# Altium project radxa_nx5_io_board_v1.4.PrjPcb (part 2 of 2)

## Sheet 12.SchDoc
size 420 x 297 mm
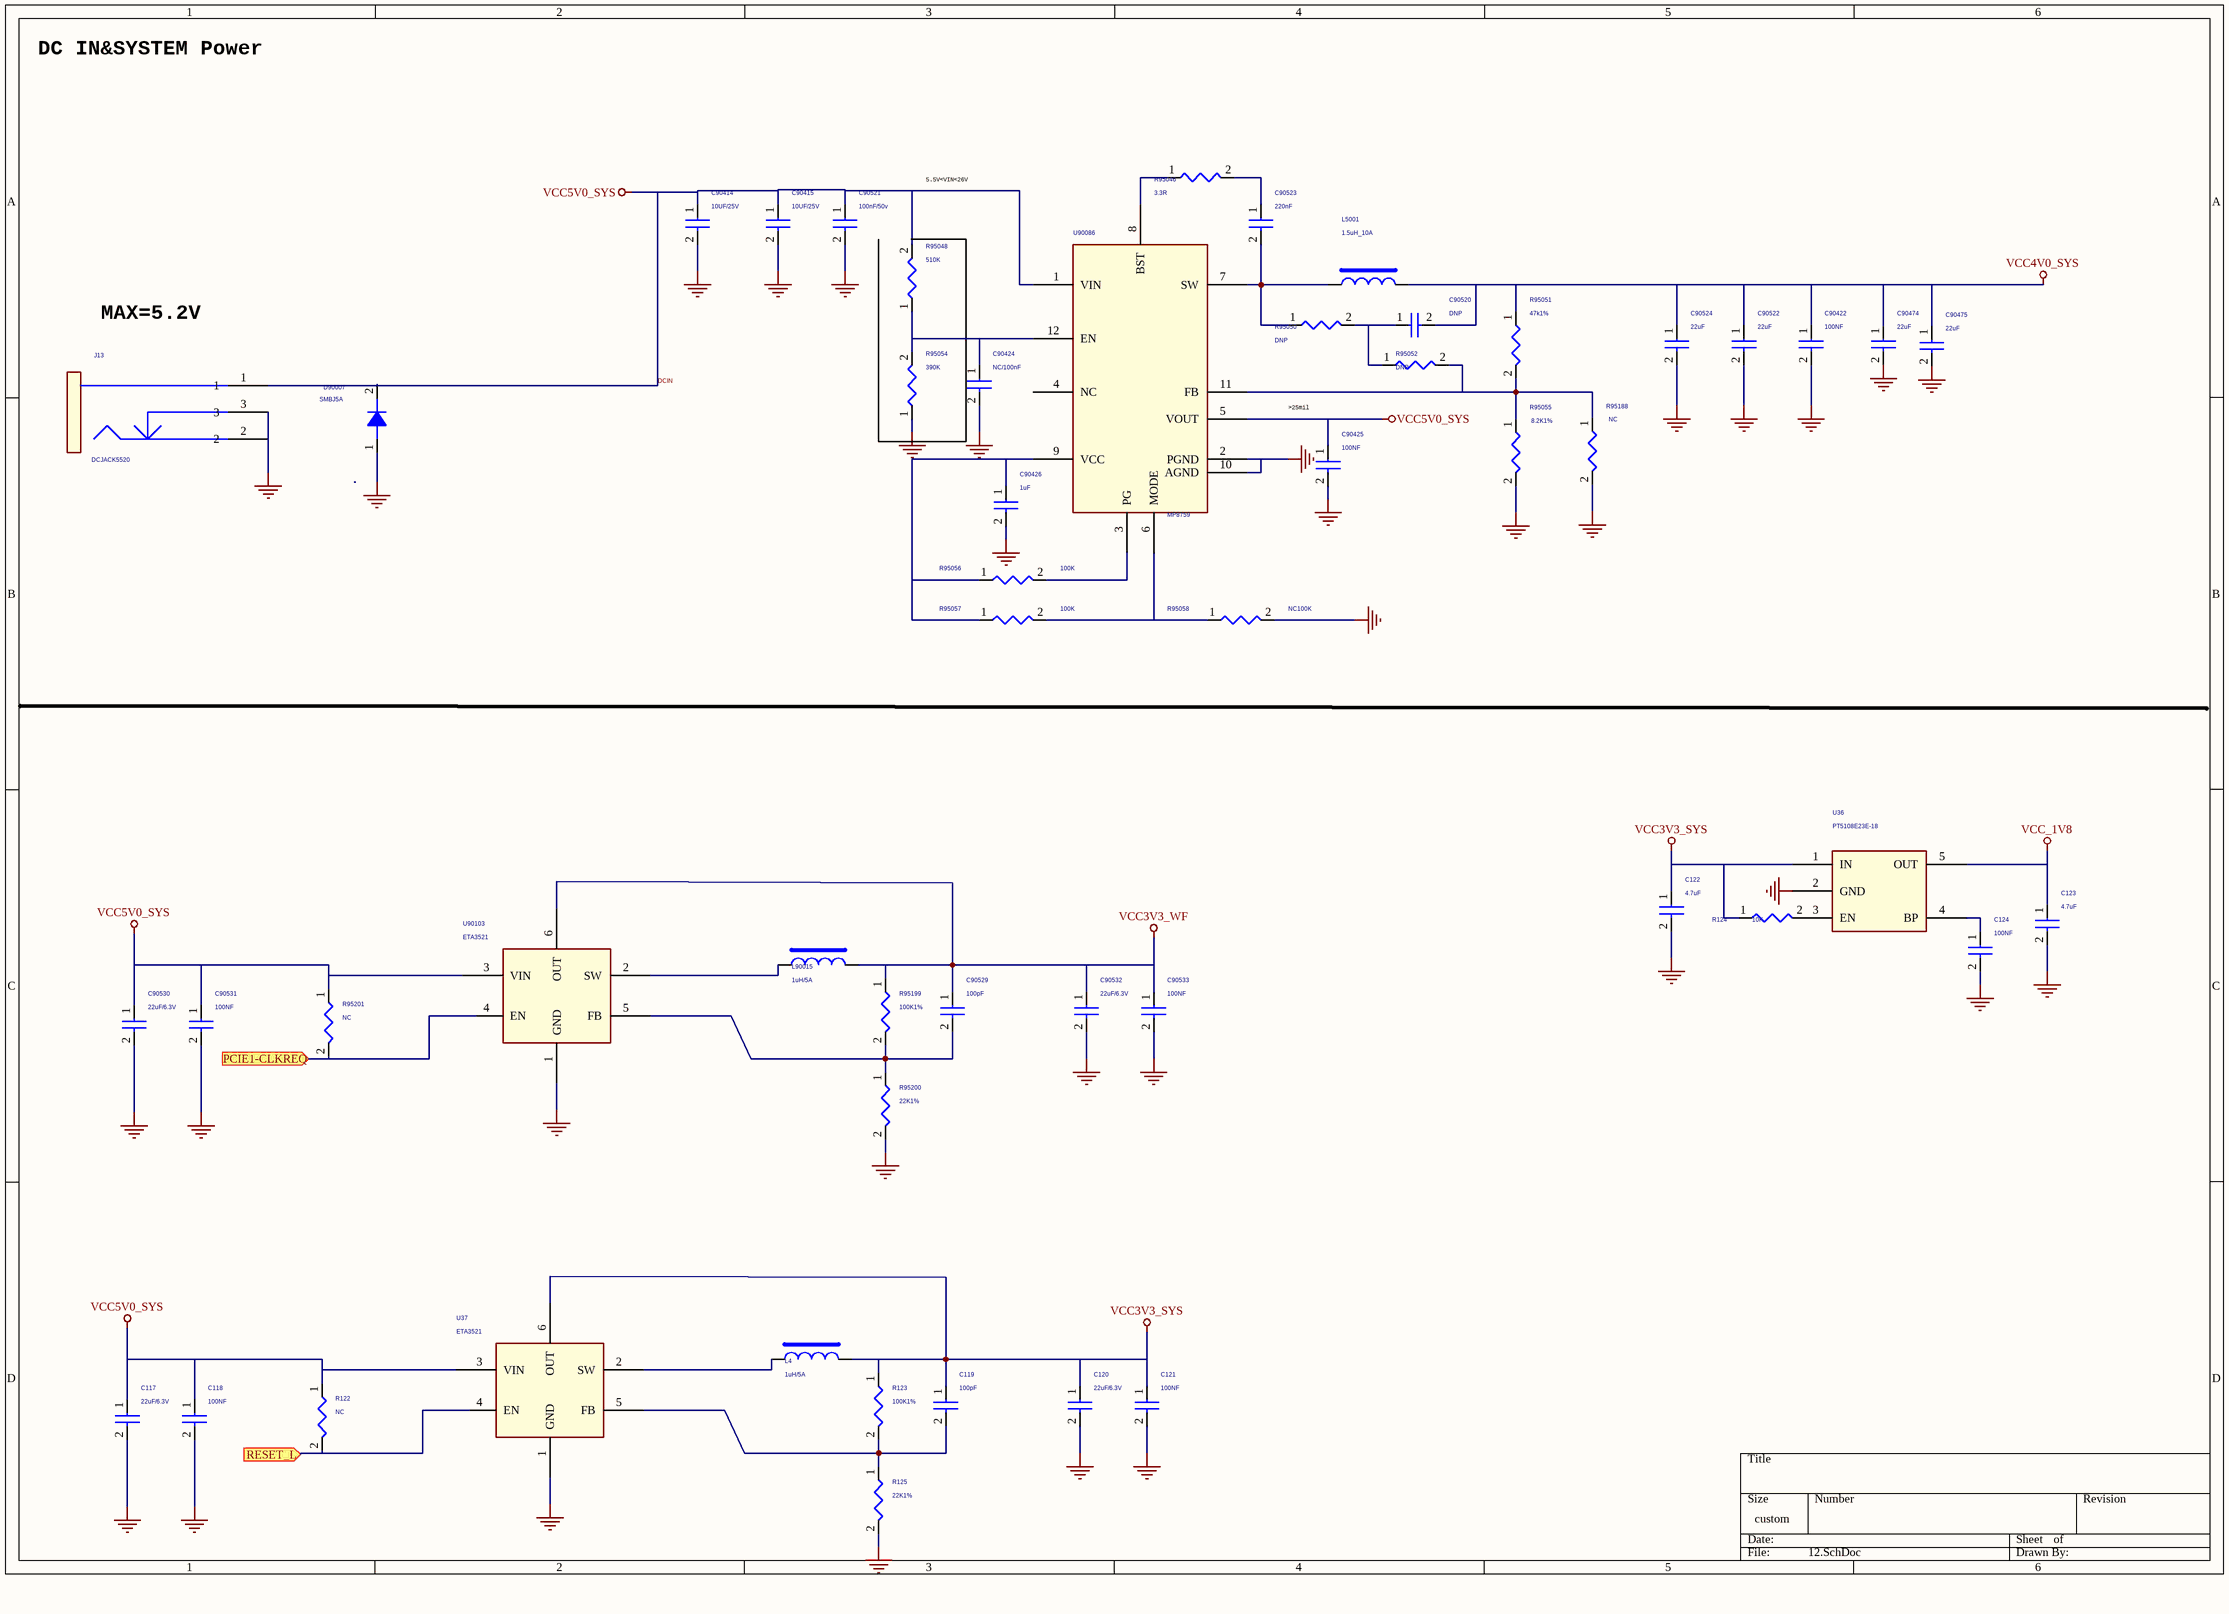
[diagram p12: 12.SchDoc]

### Parts
C117  22uF/6.3V  [C0805]
C118  100NF  [C0402]
C119  100pF  [C0402]
C120  22uF/6.3V  [C0805]
C121  100NF  [C0402]
C122  4.7uF  [c0402]
C123  4.7uF  [c0402]
C124  100NF  [C0402]
C90414  10UF/25V  [C1206]
C90415  10UF/25V  [C1206]
C90422  100NF  [C0402]
C90424  NC/100nF  [C0402]
C90425  100NF  [c0201]
C90426  1uF  [c0201]
C90474  22uF  [C0805]
C90475  22uF  [C0805]
C90520  DNP  [C0402]
C90521  100nF/50v  [C0603]
C90522  22uF  [C0805]
C90523  220nF  [C0402]
C90524  22uF  [C0805]
C90529  100pF  [C0402]
C90530  22uF/6.3V  [C0805]
C90531  100NF  [C0402]
C90532  22uF/6.3V  [C0805]
C90533  100NF  [C0402]
D90007  SMBJ5A  [DO214AA]
J13  DCJACK5520  [DCJACK5520]
L4  1uH/5A  [IND-303015]
L5001  1.5uH_10A  [IND_606045]
L90015  1uH/5A  [IND-303015]
R122  NC  [R0402]
R123  100K1%  [R0402]
R124  10K  [R0402]
R125  22K1%  [R0402]
R95046  3.3R  [R0402]
R95048  510K  [R0402]
R95050  DNP  [R0402]
R95051  47k1%  [R0402]
R95052  DNP  [R0402]
R95054  390K  [R0402]
R95055  8.2K1%  [R0402]
R95056  100K  [R0402]
R95057  100K  [R0402]
R95058  NC100K  [R0402]
R95188  NC  [R0402]
R95199  100K1%  [R0402]
R95200  22K1%  [R0402]
R95201  NC  [R0402]
U36  PT5108E23E-18  [SOT_23_5]
U37  ETA3521  [SOT563]
U90086  MP8759  [QFN12_2R00X3R00X1R00]
U90103  ETA3521  [SOT563]

### Ports
PCIE1-CLKREQ (in), RESET_L (in)

### Nets
DCIN: C117.1 C118.1 C90414.1 C90415.1 C90425.1 C90521.1 C90530.1 C90531.1 D90007.2(K) J13.1 R122.1 R95048.2 R95201.1 U37.3(VIN) U90086.1(VIN) U90086.5(VOUT) U90103.3(VIN)  [also labelled VCC5V0_SYS]
GND: C117.2 C118.2 C120.2 C121.2 C122.2 C123.2 C124.2 C90414.2 C90415.2 C90422.2 C90424.2 C90425.2 C90426.2 C90474.2 C90475.2 C90521.2 C90522.2 C90524.2 C90530.2 C90531.2 C90532.2 C90533.2 D90007.1(A) J13.2 J13.3 R125.2 R95054.1 R95055.2 R95058.2 R95188.2 R95200.2 U36.2(GND) U37.1(GND) U90086.2(PGND) U90086.10(AGND) U90103.1(GND)
VCC3V3_SYS: C119.1 C120.1 C121.1 C122.1 L4.2 R123.1 R124.1 U36.1(IN) U37.6(OUT)  [project net power-good]
VCC3V3_WF: C90529.1 C90532.1 C90533.1 L90015.2 R95199.1 U90103.6(OUT)
VCC4V0_SYS: C90422.1 C90474.1 C90475.1 C90520.2 C90522.1 C90524.1 L5001.2 R95051.1
VCC_1V8: C123.1 U36.5(OUT)
NetC119_2: C119.2 R123.2 R125.1 U37.5(FB)
NetC124_1: C124.1 U36.4(BP)
NetC90424_1: C90424.1 R95048.1 R95054.2 U90086.12(EN)
NetC90426_1: C90426.1 R95056.1 R95057.1 U90086.9(VCC)
NetC90520_1: C90520.1 R95050.2 R95052.1
NetC90523_1: C90523.1 R95046.2
NetC90523_2: C90523.2 L5001.1 R95050.1 U90086.7(SW)
NetC90529_2: C90529.2 R95199.2 R95200.1 U90103.5(FB)
NetL4_1: L4.1 U37.2(SW)
NetL90015_1: L90015.1 U90103.2(SW)
NetR122_2: R122.2 U37.4(EN) ; port RESET_L
NetR124_2: R124.2 U36.3(EN)
NetR95046_1: R95046.1 U90086.8(BST)
NetR95051_2: R95051.2 R95052.2 R95055.1 R95188.1 U90086.11(FB)
NetR95056_2: R95056.2 U90086.3(PG)
NetR95057_2: R95057.2 R95058.1 U90086.6(MODE)
NetR95201_2: R95201.2 U90103.4(EN) ; port PCIE1-CLKREQ

Not connected (* = marked no-connect by the designer): U90086 4(NC)

### Notes on the sheet
- DC IN&SYSTEM Power
- 5.5V<VIN<26V
- MAX=5.2V
- >25mil

### Library data of the parts
C117 C90530 = CAP NP: cap,10.00uF,+/-10%,25V,X5R,C0805; Manufacturer PN: C2012X5R1E106K085AC; Manufacturer: TDK; Tolerance: 10%; Priority: A; Voltage: 25V; Dielectric: X5R; Created by: JJJ; Part Type: C0805; RK PN: C2012X5R1E106K085AC
C118 = CAP NP: cap,100.00nF,+/-10%,25V,X5R,C0402; Manufacturer: TDK; RK PN: C1005X5R1E104K050BC; Priority: A; Tolerance: 10%; Voltage: 25V; Dielectric: X5R; Part Type: C0402; Manufacturer PN: C1005X5R1E104K050BC; Created by: JJJ
C119 C90529 = CAP NP: cap,100.00pF,+/-5%,50V,C0G,C0402; Manufacturer PN: C1005C0G1H101J050BA; Manufacturer: TDK; Tolerance: 5%; Priority: A; Voltage: 50V; Dielectric: C0G; Created by: JJJ; Part Type: C0402; RK PN: C1005C0G1H101J050BA
C120 C90532 = CAP NP: cap,10.00uF,+/-10%,10V,X5R,C0805; Manufacturer PN: C2012X5R1A106K125AB; Manufacturer: TDK; Tolerance: 10%; Priority: A; Voltage: 10V; Dielectric: X5R; Created by: JJJ; Part Type: C0805; RK PN: C2012X5R1A106K125AB
C121 C90533 = CAP NP: cap,100.00nF,+/-10%,10V,X5R,C0402; Manufacturer: TDK; RK PN: C1005X5R1A104K050BA; Priority: A; Tolerance: 10%; Voltage: 10V; Dielectric: X5R; Part Type: C0402; Manufacturer PN: C1005X5R1A104K050BA; Created by: JJJ
C122 = CAP NP: cap,4.70uF,+/-10%,10V,X5R,C0603; Manufacturer PN: C1608X5R1A475K080AC; Manufacturer: TDK; Tolerance: 10%; Priority: A; Voltage: 10V; Dielectric: X5R; Created by: JJJ; Part Type: C0603; RK PN: C1608X5R1A475K080AC
C123 = CAP NP: cap,4.70uF,+/-10%,10V,X5R,C0603; Manufacturer: TDK; RK PN: C1608X5R1A475K080AC; Priority: A; Tolerance: 10%; Voltage: 10V; Dielectric: X5R; Part Type: C0603; Manufacturer PN: C1608X5R1A475K080AC; Created by: JJJ
C124 = CAP NP: as C90195 on sheet 07; Voltage: 16V; Dielectric: X5R; Part Type: C0402; Manufacturer PN: C1005X5R1C104K050BA; Created by: JJJ
C90414 = CAP NP: cap,10.00uF,+/-10%,25V,X5R,C1206; Manufacturer PN: C3216X5R1E106K085AC; Manufacturer: TDK; Tolerance: 10%; C_Voltage: 6.3V; Priority: A; Voltage: 25V; Dielectric: X5R; Created by: JJJ; Part Type: C1206; RK PN: C3216X5R1E106K085AC
C90415 = CAP NP: cap,10.00uF,+/-10%,25V,X5R,C1206; Manufacturer: TDK; RK PN: C3216X5R1E106K085AC; Priority: A; C_Voltage: 6.3V; Tolerance: 10%; Voltage: 25V; Dielectric: X5R; Part Type: C1206; Manufacturer PN: C3216X5R1E106K085AC; Created by: JJJ
C90422 C90425 = CAP NP: cap,100.00nF,+/-10%,10V,X5R,C0402; Manufacturer: TDK; Number: 37; RK PN: C1005X5R1A104K050BA; Priority: A; Tolerance: 10%; C_Voltage: 6.3V; Voltage: 10V; Dielectric: X5R; Part Type: C0402; Manufacturer PN: C1005X5R1A104K050BA; Created by: JJJ
C90424 = CAP NP: cap,100.00nF,+/-10%,25V,X5R,C0402; Manufacturer PN: C1005X5R1E104K050BC; Manufacturer: TDK; C_Voltage: 6.3V; Tolerance: 10%; Priority: A; Number: 37; Option: DNP; Voltage: 25V; Dielectric: X5R; Created by: JJJ; Part Type: C0402; RK PN: C1005X5R1E104K050BC
C90426 = CAP NP: cap,1.00uF,+/-10%,10V,X5R,C0402; Manufacturer: TDK; Number: 37; RK PN: C1005X5R1A105K050BB; Priority: A; Tolerance: 10%; C_Voltage: 6.3V; Voltage: 10V; Dielectric: X5R; Part Type: C0402; Manufacturer PN: C1005X5R1A105K050BB; Created by: JJJ
C90474 C90475 C90524 = CAP NP: cap,22.00uF,+/-10%,10V,X5R,C0805; Manufacturer PN: C2012X5R1A226K125AB; Manufacturer: TDK; Tolerance: 10%; C_Voltage: 6.3V; Priority: A; Voltage: 10V; Dielectric: X5R; Created by: JJJ; Part Type: C0805; RK PN: C2012X5R1A226K125AB
C90520 = CAP NP: Did Not Place.; Manufacturer PN: DNPC0402; C_Voltage: 6.3V; Priority: A; Number: 37; Created by: JJJ; Part Type: DNP; RK PN: DNPC0402
C90521 = CAP NP: cap,100.00nF,+/-10%,50V,X5R,C0603; Manufacturer PN: C1608X5R1H104K080AA; Manufacturer: TDK; Tolerance: 10%; Priority: A; Voltage: 50V; Dielectric: X5R; Created by: JJJ; Part Type: C0603; RK PN: C1608X5R1H104K080AA
C90522 = CAP NP: cap,22.00uF,+/-10%,10V,X5R,C0805; Manufacturer: TDK; RK PN: C2012X5R1A226K125AB; Priority: A; C_Voltage: 6.3V; Tolerance: 10%; Voltage: 10V; Dielectric: X5R; Part Type: C0805; Manufacturer PN: C2012X5R1A226K125AB; Created by: JJJ
C90523 = CAP NP: cap,220.00nF,+/-10%,25V,X5R,C0402; Manufacturer PN: C1005X5R1E224K050BC; Manufacturer: TDK; C_Voltage: 6.3V; Tolerance: 10%; Priority: A; Number: 37; Voltage: 25V; Dielectric: X5R; Created by: JJJ; Part Type: C0402; RK PN: C1005X5R1E224K050BC
C90531 = CAP NP: cap,100.00nF,+/-10%,25V,X5R,C0402; Manufacturer PN: C1005X5R1E104K050BC; Manufacturer: TDK; Tolerance: 10%; Priority: A; Voltage: 25V; Dielectric: X5R; Created by: JJJ; Part Type: C0402; RK PN: C1005X5R1E104K050BC
D90007 = DIODE_Dup2: Schottky Barrier，SS32 DO214AC; Manufacturer PN: SS32; Manufacturer: 星海; Priority: A; Created by: JJJ; Part Type: Schottky rectifier; RK PN: SS32
L4 L90015 = INDUCTORS OF FERRITE: Power Inductor,3.3uH,0.2,IND_404030; Manufacturer: sunlord; Isat: 3.3A; DC Resistor: 0.04ohm; RK PN: SWPA4030S3R3MT; Priority: A; Tolerance: 20%; Irms: 2.4A; Resonace frequency: 38M; Part Type: POWER_IND; Manufacturer PN: SWPA4030S3R3MT; Created by: YTL
L5001 = INDUCTORS OF FERRITE: Power Inductor,1.5uH,MWSA0603S-1R5MT; Manufacturer: Vishay; Isat: 9.6A; Priority: A; Tolerance: 20%; Irms: 10.5A; Option: >8A; Part Type: IND; Created by: JJJ
R122 R95054 R95057 R95201 = RESISTOR: as R95119 on sheet 04; Created by: YTL; Part Type: 通用厚膜电阻; RK PN: RC0402JR-07100KL
R123 R95199 = RESISTOR: 通用厚膜电阻,75K,+/-1%,R0402,1/16W.; Manufacturer PN: RC0402FR-0775KL; Manufacturer: YAGEO; Tolerance: 1%; Wattage: 1/16W; Priority: A; Created by: YTL; Part Type: 通用厚膜电阻; RK PN: RC0402FR-0775KL
R124 = RESISTOR: as R95096 on sheet 04; Part Type: 通用厚膜电阻; Manufacturer PN: RC0402JR-0710KL; Created by: YTL
R125 R95200 = RESISTOR: 通用厚膜电阻,10K,+/-1%,R0402,1/16W.; Manufacturer: YAGEO; Tolerance: 1%; RK PN: RC0402FR-0710KL; Priority: A; Wattage: 1/16W; Part Type: 通用厚膜电阻; Manufacturer PN: RC0402FR-0710KL; Created by: YTL
R95046 = RESISTOR: 通用厚膜电阻,3R3,+/-5%,R0402,1/16W.; Manufacturer PN: RC0402JR-073R3L; Manufacturer: YAGEO; Tolerance: 5%; Wattage: 1/16W; Priority: A; Created by: YTL; Part Type: 通用厚膜电阻; RK PN: RC0402JR-073R3L
R95048 = RESISTOR: 通用厚膜电阻,510K,+/-5%,R0402,1/16W.; Manufacturer PN: RC0402JR-07510KL; Manufacturer: YAGEO; Tolerance: 5%; Wattage: 1/16W; Priority: A; Created by: YTL; Part Type: 通用厚膜电阻; RK PN: RC0402JR-07510KL
R95050 R95052 = RESISTOR: Did Not Place.; RK PN: DNPR0402; Priority: A; Part Type: DNP; Manufacturer PN: DNPR0402; Created by: JJJ
R95051 = RESISTOR: 通用厚膜电阻,43K,+/-1%,R0402,1/16W.; Manufacturer: YAGEO; Tolerance: 1%; RK PN: RC0402FR-0743KL; Priority: A; Wattage: 1/16W; Part Type: 通用厚膜电阻; Manufacturer PN: RC0402FR-0743KL; Created by: YTL
R95055 R95188 = RESISTOR: 通用厚膜电阻,7K5,+/-1%,R0402,1/16W.; Manufacturer PN: RC0402FR-077K5L; Manufacturer: YAGEO; Tolerance: 1%; Wattage: 1/16W; Priority: A; Created by: YTL; Part Type: 通用厚膜电阻; RK PN: RC0402FR-077K5L
R95056 = RESISTOR: 通用厚膜电阻,100K,+/-5%,R0402,1/16W.; Manufacturer: YAGEO; Tolerance: 5%; RK PN: RC0402JR-07100KL; Priority: A; Wattage: 1/16W; Part Type: 通用厚膜电阻; Manufacturer PN: RC0402JR-07100KL; Created by: YTL
R95058 = RESISTOR: 通用厚膜电阻,100K,+/-5%,R0402,1/16W.; Manufacturer PN: RC0402JR-07100KL; Manufacturer: YAGEO; Tolerance: 5%; Wattage: 1/16W; Priority: A; Option: DNP; Created by: YTL; Part Type: 通用厚膜电阻; RK PN: RC0402JR-07100KL
U36 = LDO_PT5108: 1.8V Output,300mA, Low Dropout, Low Noise Ultra-Fast Without Bypass Capacitor CMOS LDO Regulator; Manufacturer PN: RT9193-18GB; Manufacturer: Richtek（立錡）; Priority: A; Created by: JJJ; Part Type: LDO; RK PN: RT9193-18GB
U90086 = MP8759_6

## Sheet 13.SchDoc
size 513 x 386 mm
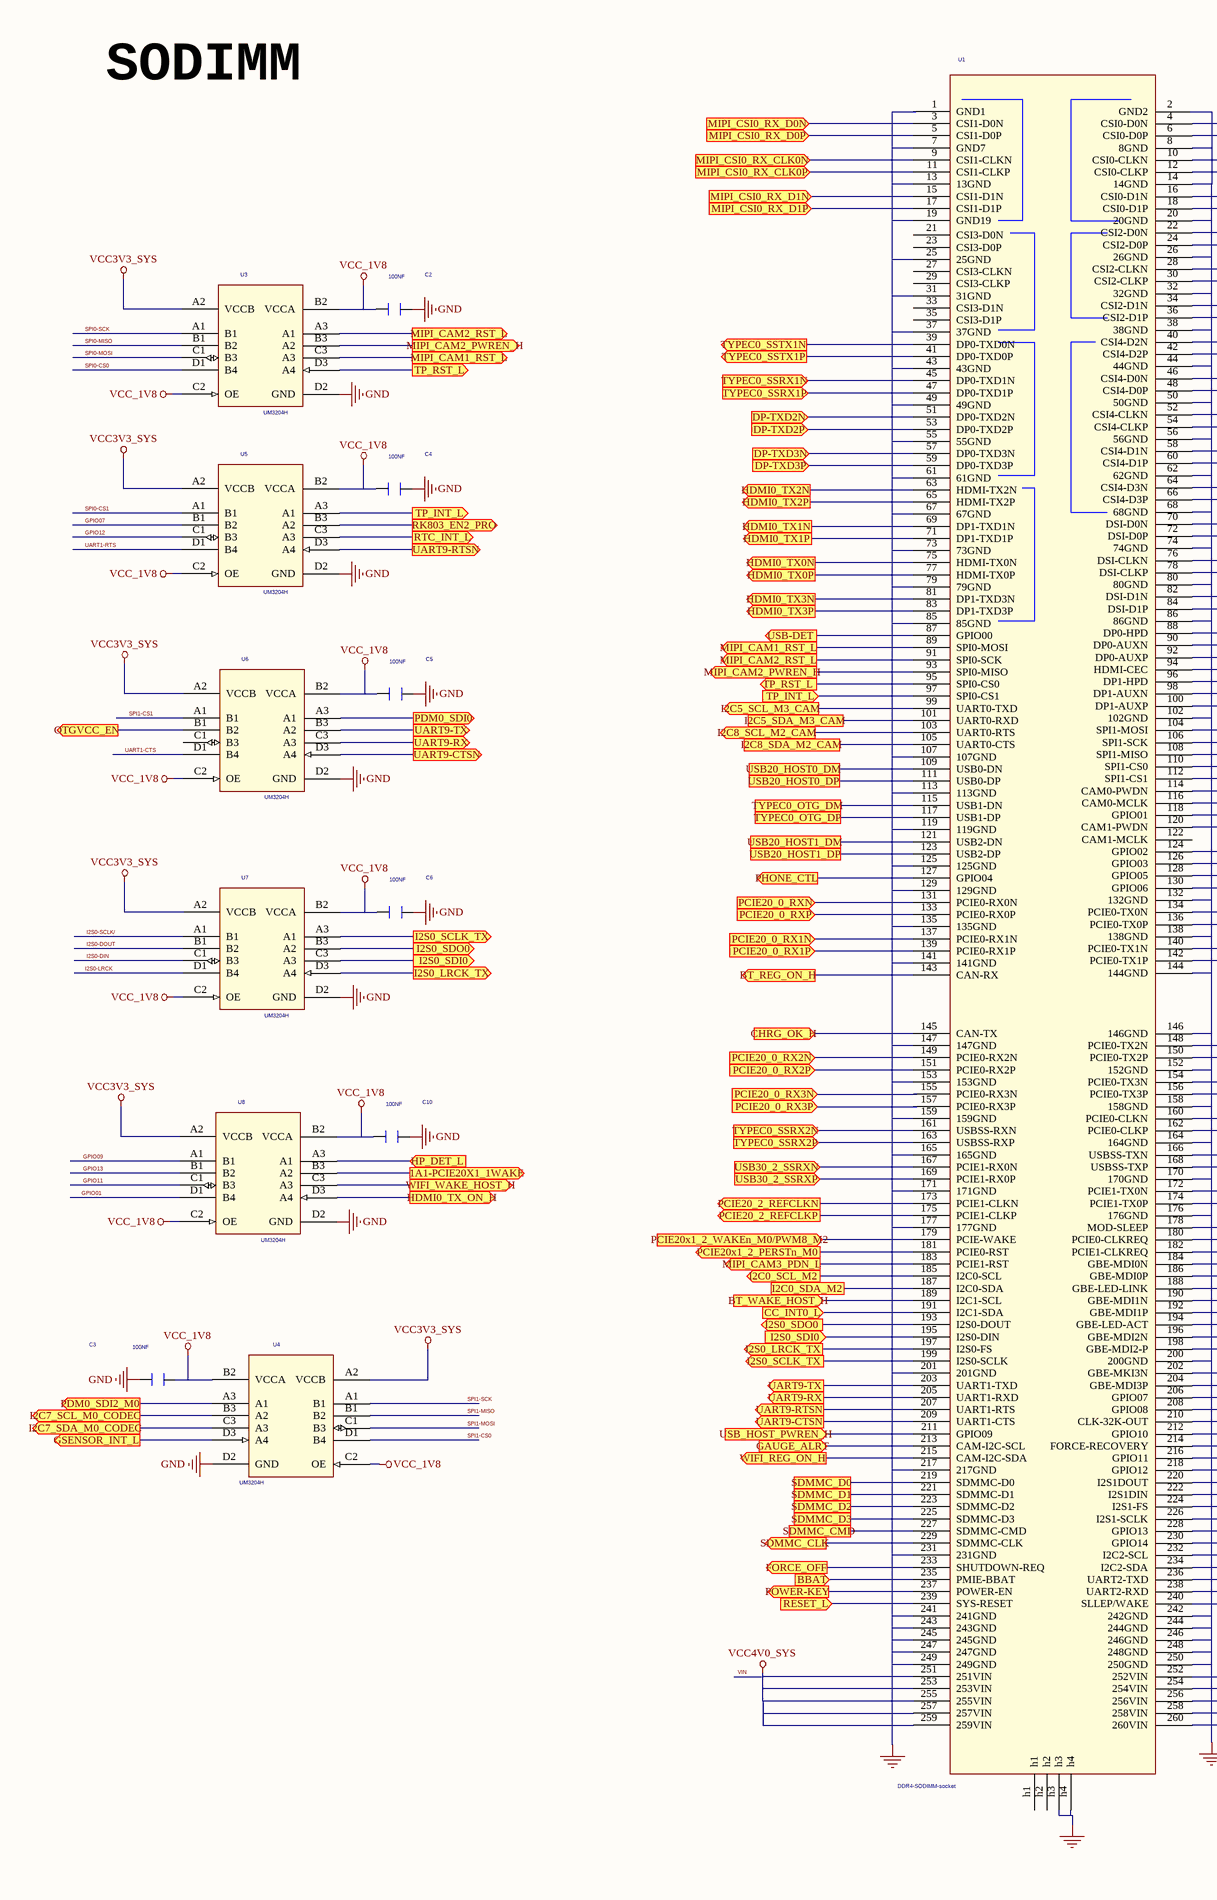
[diagram p13: 13.SchDoc, left]
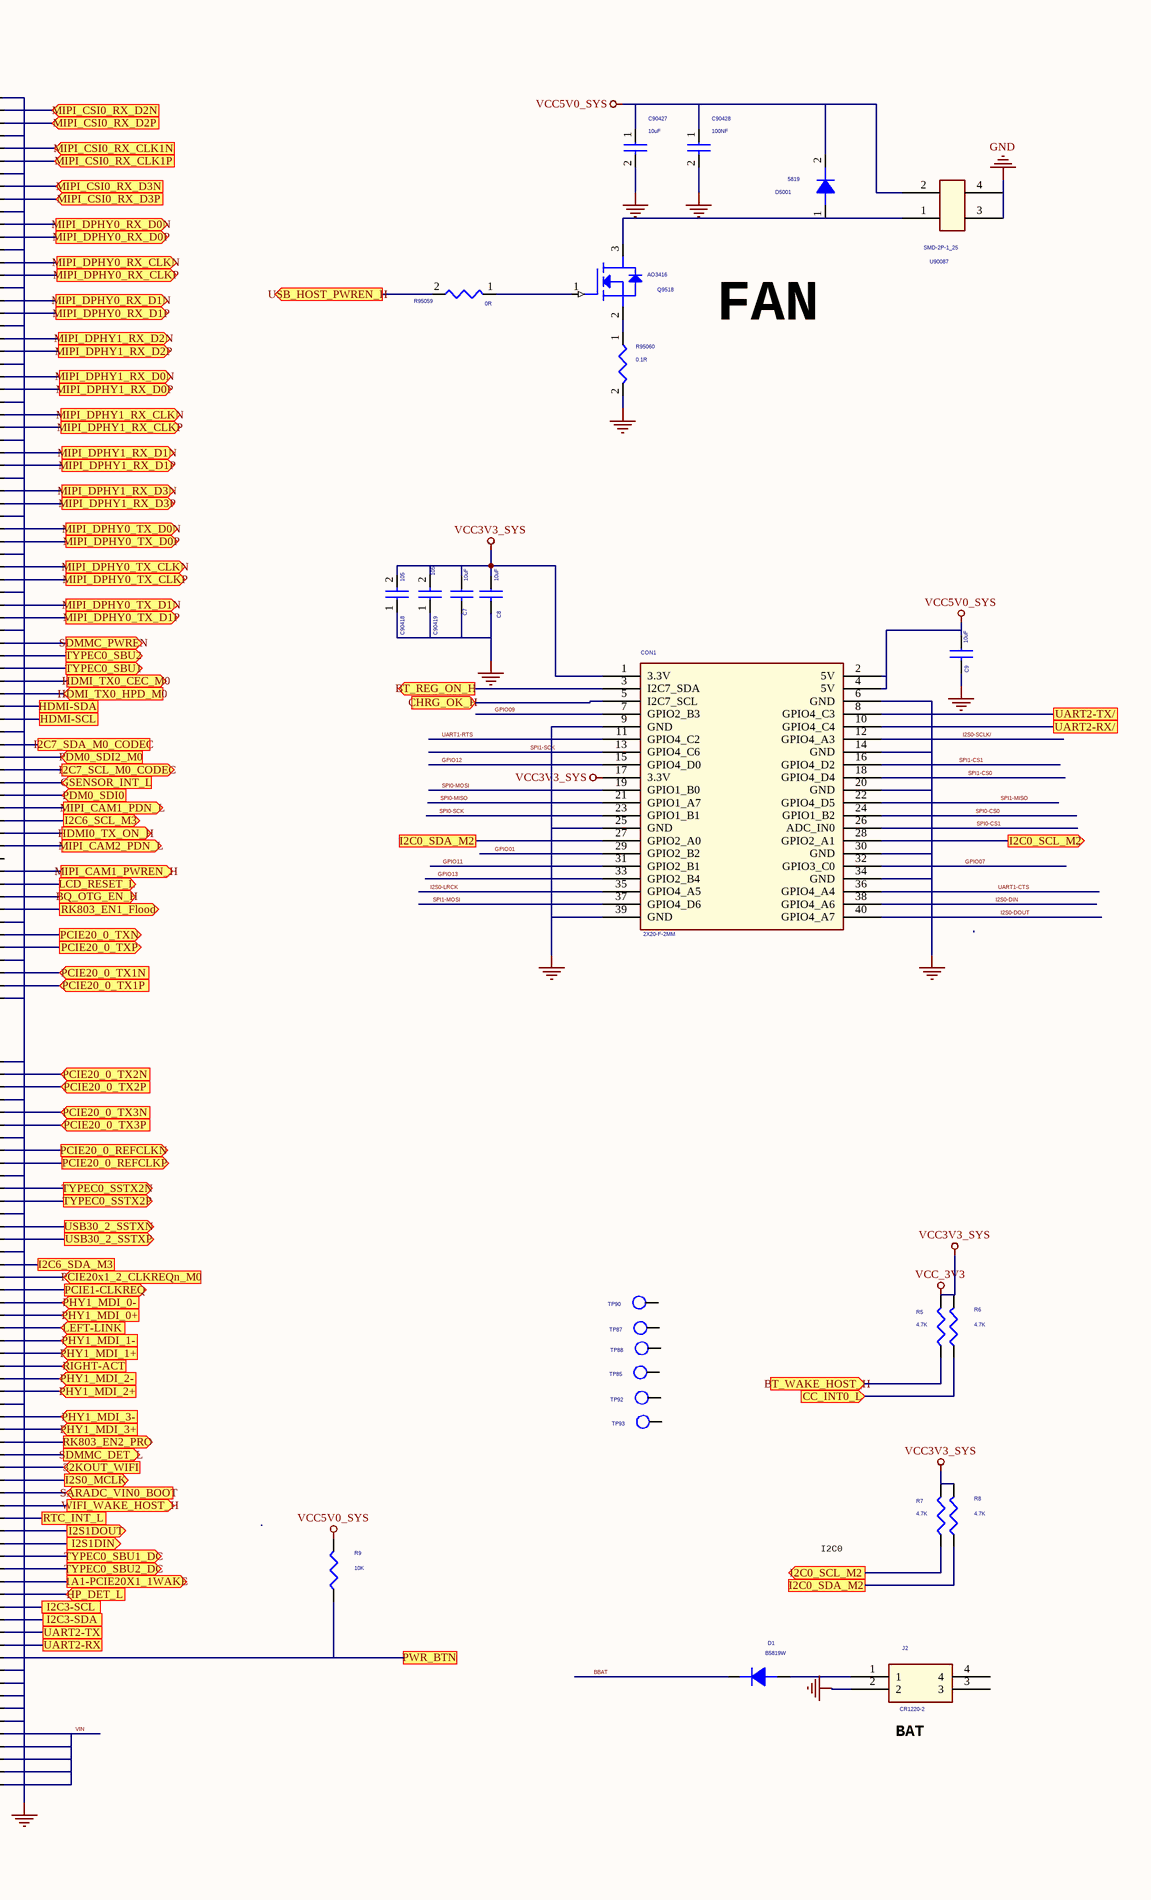
[diagram p14: 13.SchDoc, right]

### Parts
C2  100NF  [C0402]
C3  100NF  [C0402]
C4  100NF  [C0402]
C5  100NF  [C0402]
C6  100NF  [C0402]
C7  10uF  [C0603]
C8  10uF  [C0603]
C9  10uF  [C0603]
C10  100NF  [C0402]
C90418  105  [C0402]
C90419  105  [C0402]
C90427  10uF  [C1206]
C90428  100NF  [C0402]
CON1  2X20-F-2MM  [DIP40PIN-2.54MM_FX]
D1  B5819W  [SOD_123]
D5001  5819  [SOD_123]
J2  CR1220-2  [CR1220-2]
Q9518  AO3416  [SOT23]
R5  4.7K  [R0402]
R6  4.7K  [R0402]
R7  4.7K  [R0402]
R8  4.7K  [R0402]
R9  10K  [R0402]
R95059  0R  [R0402]
R95060  0.1R  [R0402]
TP85  TP  [tp1-8040]  (value not drawn)
TP87  TP  [tp1-8040]  (value not drawn)
TP88  TP  [tp1-8040]  (value not drawn)
TP90  TP  [tp1-8040]  (value not drawn)
TP92  TP  [tp1-8040]  (value not drawn)
TP93  TP  [tp1-8040]  (value not drawn)
U1  DDR4-SODIMM-socket  [DDR4-SODIMM-socket]
U3  UM3204H  [CSP-12]
U4  UM3204H  [CSP-12]
U5  UM3204H  [CSP-12]
U6  UM3204H  [CSP-12]
U7  UM3204H  [CSP-12]
U8  UM3204H  [CSP-12]
U90087  SMD-2P-1_25  [SMD-2P-1_25]

### Ports
1A1-PCIE20X1_1WAKE (out), 32KOUT_WIFI (in), BBAT (in), BQ_OTG_EN_H (out), BT_REG_ON_H (out), BT_WAKE_HOST_H (in), CC_INT0_L (in), CHRG_OK_H (in), DP-TXD2N (in), DP-TXD2P (in), DP-TXD3N (in), DP-TXD3P (in), FORCE_OFF (out), GAUGE_ALRT (in), GSENSOR_INT_L (in), GSENSOR_INT_L (out), HDMI0_TX0N (out), HDMI0_TX0P (out), HDMI0_TX1N (out), HDMI0_TX1P (out), HDMI0_TX2N (out), HDMI0_TX2P (out), HDMI0_TX3N (out), HDMI0_TX3P (out), HDMI0_TX_ON_H (out), HDMI-SCL, HDMI-SDA, HDMI_TX0_CEC_M0 (out), HDMI_TX0_HPD_M0 (in), HP_DET_L (in), I2C0_SCL_M2 (out), I2C0_SDA_M2, I2C3-SCL, I2C3-SDA, I2C5_SCL_M3_CAM (out), I2C5_SDA_M3_CAM, I2C6_SCL_M3 (out), I2C6_SDA_M3, I2C7_SCL_M0_CODEC (out), I2C7_SDA_M0_CODEC, I2C7_SDA_M0_CODEC (out), I2C8_SCL_M2_CAM (out), I2C8_SDA_M2_CAM, I2S0_LRCK_TX (out), I2S0_MCLK (out), I2S0_SCLK_TX (out), I2S0_SDI0 (in), I2S0_SDI0 (out), I2S0_SDO0 (out), I2S1DIN (out), I2S1DOUT (out), LCD_RESET_L (out), LEFT-LINK (in), MIPI_CAM1_PDN_L (out), MIPI_CAM1_PWREN_H (out), MIPI_CAM1_RST_L (out), MIPI_CAM2_PDN_L (out), MIPI_CAM2_PWREN_H (out), MIPI_CAM2_RST_L (out), MIPI_CAM3_PDN_L (out), MIPI_CSI0_RX_CLK0N (in), MIPI_CSI0_RX_CLK0P (in), MIPI_CSI0_RX_CLK1N (in), MIPI_CSI0_RX_CLK1P (in), MIPI_CSI0_RX_D0N (in), MIPI_CSI0_RX_D0P (in), MIPI_CSI0_RX_D1N (in), MIPI_CSI0_RX_D1P (in), MIPI_CSI0_RX_D2N (in), MIPI_CSI0_RX_D2P (in), MIPI_CSI0_RX_D3N (in), MIPI_CSI0_RX_D3P (in), MIPI_DPHY0_RX_CLKN (out), MIPI_DPHY0_RX_CLKP (out), MIPI_DPHY0_RX_D0N (out), MIPI_DPHY0_RX_D0P (out), MIPI_DPHY0_RX_D1N (out), MIPI_DPHY0_RX_D1P (out), MIPI_DPHY0_TX_CLKN (out), MIPI_DPHY0_TX_CLKP (out), MIPI_DPHY0_TX_D0N (out), MIPI_DPHY0_TX_D0P (out), MIPI_DPHY0_TX_D1N (out), MIPI_DPHY0_TX_D1P (out), MIPI_DPHY1_RX_CLKN (out), MIPI_DPHY1_RX_CLKP (out), MIPI_DPHY1_RX_D0N (out), MIPI_DPHY1_RX_D0P (out), MIPI_DPHY1_RX_D1N (out), MIPI_DPHY1_RX_D1P (out), MIPI_DPHY1_RX_D2N (out), MIPI_DPHY1_RX_D2P (out), MIPI_DPHY1_RX_D3N (out), MIPI_DPHY1_RX_D3P (out), OTGVCC_EN (out), PCIE1-CLKREQ (out), PCIE20_0_REFCLKN (out), PCIE20_0_REFCLKP (out), PCIE20_0_RX1N (in), PCIE20_0_RX1P (in), PCIE20_0_RX2N (in), PCIE20_0_RX2P (in), PCIE20_0_RX3N (in), PCIE20_0_RX3P (in), PCIE20_0_RXN (in), PCIE20_0_RXP (in), PCIE20_0_TX1N (in), PCIE20_0_TX1P (in), PCIE20_0_TX2N (in), PCIE20_0_TX2P (in), PCIE20_0_TX3N (in), PCIE20_0_TX3P (in), PCIE20_0_TXN (out), PCIE20_0_TXP (out), PCIE20_2_REFCLKN (out), PCIE20_2_REFCLKP (out), PCIE20x1_2_CLKREQn_M0 (in), PCIE20x1_2_PERSTn_M0 (out), PCIE20x1_2_WAKEn_M0/PWM8_M2 (in), PDM0_SDI0 (in), PDM0_SDI0 (out), PDM0_SDI2_M0 (in), PDM0_SDI2_M0 (out), PHONE_CTL (out), PHY1_MDI_0+ (in), PHY1_MDI_0- (in), PHY1_MDI_1+ (in), PHY1_MDI_1- (in), PHY1_MDI_2+ (in), PHY1_MDI_2- (in), PHY1_MDI_3+ (in), PHY1_MDI_3- (in), POWER-KEY (out), PWR_BTN, RESET_L (in), RIGHT-ACT (in), RK803_EN1_Flood (out), RK803_EN2_PRO (out), RTC_INT_L, RTC_INT_L (out), SARADC_VIN0_BOOT (in), SDMMC_CLK (out), SDMMC_CMD, SDMMC_D0, SDMMC_D1, SDMMC_D2, SDMMC_D3, SDMMC_DET_L (out), SDMMC_PWREN (out), TP_INT_L (in), TP_INT_L (out), TP_RST_L (out), TYPEC0_OTG_DM, TYPEC0_OTG_DP, TYPEC0_SBU1 (out), TYPEC0_SBU1_DC (out), TYPEC0_SBU2 (out), TYPEC0_SBU2_DC (out), TYPEC0_SSRX1N (in), TYPEC0_SSRX1P (in), TYPEC0_SSRX2N (in), TYPEC0_SSRX2P (in), TYPEC0_SSTX1N (out), TYPEC0_SSTX1P (out), TYPEC0_SSTX2N (out), TYPEC0_SSTX2P (out), UART2-RX, UART2-RX/, UART2-TX, UART2-TX/, UART9-CTSN (out), UART9-RTSN (out), UART9-RX (out), UART9-TX (out), USB20_HOST0_DM, USB20_HOST0_DP, USB20_HOST1_DM, USB20_HOST1_DP, USB30_2_SSRXN (in), USB30_2_SSRXP (in), USB30_2_SSTXN (out), USB30_2_SSTXP (out), USB-DET (out), USB_HOST_PWREN_H (in), USB_HOST_PWREN_H (out), WIFI_REG_ON_H (out), WIFI_WAKE_HOST_H (out)

### Nets
GND: C2.1 C3.1 C4.1 C5.1 C6.1 C7.2 C8.2 C9.2 C10.1 C90418.1 C90419.1 C90427.2 C90428.2 CON1.6(GND) CON1.9(GND) CON1.14(GND) CON1.20(GND) CON1.25(GND) CON1.30(GND) CON1.34(GND) CON1.39(GND) J2.2 R95060.2 U1.1(GND1) U1.2(GND2) U1.7(GND7) U1.8(8GND) U1.13(13GND) U1.14(14GND) U1.19(GND19) U1.20(20GND) U1.25(25GND) U1.26(26GND) U1.31(31GND) U1.32(32GND) U1.37(37GND) U1.38(38GND) U1.43(43GND) U1.44(44GND) U1.49(49GND) U1.50(50GND) U1.55(55GND) U1.56(56GND) U1.61(61GND) U1.62(62GND) U1.67(67GND) U1.68(68GND) U1.73(73GND) U1.74(74GND) U1.79(79GND) U1.80(80GND) U1.85(85GND) U1.86(86GND) U1.102(102GND) U1.107(107GND) U1.113(113GND) U1.119(119GND) U1.125(125GND) U1.129(129GND) U1.132(132GND) U1.135(135GND) U1.138(138GND) U1.141(141GND) U1.144(144GND) U1.146(146GND) U1.147(147GND) U1.152(152GND) U1.153(153GND) U1.158(158GND) U1.159(159GND) U1.164(164GND) U1.165(165GND) U1.170(170GND) U1.171(171GND) U1.176(176GND) U1.177(177GND) U1.200(200GND) U1.201(201GND) U1.217(217GND) U1.231(231GND) U1.241(241GND) U1.242(242GND) U1.243(243GND) U1.244(244GND) U1.245(245GND) U1.246(246GND) U1.247(247GND) U1.248(248GND) U1.249(249GND) U1.250(250GND) U1.h3 U1.h4 U3.D2(GND) U4.D2(GND) U5.D2(GND) U6.D2(GND) U7.D2(GND) U8.D2(GND) U90087.3 U90087.4
VCC3V3_SYS: C7.1 C8.1 C90418.2 C90419.2 CON1.1(3.3V) CON1.17(3.3V) R5.2 R6.2 R7.2 R8.2 U3.A2(VCCB) U4.A2(VCCB) U5.A2(VCCB) U6.A2(VCCB) U7.A2(VCCB) U8.A2(VCCB)  [also labelled VCC_3V3]  [project net power-good]
VCC4V0_SYS: U1.251(251VIN) U1.253(253VIN) U1.255(255VIN) U1.257(257VIN) U1.259(259VIN)
VCC5V0_SYS: C9.1 C90427.1 C90428.1 CON1.2(5V) CON1.4(5V) D5001.2(K) R9.2 U90087.2  [project net DCIN]
VCC_1V8: C2.2 C3.2 C4.2 C5.2 C6.2 C10.2 U3.B2(VCCA) U3.C2(OE) U4.B2(VCCA) U4.C2(OE) U5.B2(VCCA) U5.C2(OE) U6.B2(VCCA) U6.C2(OE) U7.B2(VCCA) U7.C2(OE) U8.B2(VCCA) U8.C2(OE)
BBAT: D1.2(K)
GPIO01: CON1.29(GPIO2_B2) U8.D1(B4)
GPIO07: CON1.32(GPIO3_C0) U5.B1(B2)
GPIO09: CON1.7(GPIO2_B3) U8.A1(B1)
GPIO11: CON1.31(GPIO2_B1) U8.C1(B3)
GPIO12: CON1.15(GPIO4_D0) U5.C1(B3)
GPIO13: CON1.33(GPIO2_B4) U8.B1(B2)
HDMI1_TX0N_PORT/eDP1_TX_D0N: U1.75(HDMI-TX0N) ; port HDMI0_TX0N
HDMI1_TX0P_PORT/eDP1_TX_D0P: U1.77(HDMI-TX0P) ; port HDMI0_TX0P
HDMI1_TX1N_PORT/eDP1_TX_D1N: U1.69(DP1-TXD1N) ; port HDMI0_TX1N
HDMI1_TX1P_PORT/eDP1_TX_D1P: U1.71(DP1-TXD1P) ; port HDMI0_TX1P
HDMI1_TX2N_PORT/eDP1_TX_D2N: U1.63(HDMI-TX2N) ; port HDMI0_TX2N
HDMI1_TX2P_PORT/eDP1_TX_D2P: U1.65(HDMI-TX2P) ; port HDMI0_TX2P
HDMI1_TX3N_PORT/eDP1_TX_D3N: U1.81(DP1-TXD3N) ; port HDMI0_TX3N
HDMI1_TX3P_PORT/eDP1_TX_D3P: U1.83(DP1-TXD3P) ; port HDMI0_TX3P
I2S0-DIN: CON1.38(GPIO4_A6) U7.C1(B3)
I2S0-DOUT: CON1.40(GPIO4_A7) U7.B1(B2)
I2S0-LRCK: CON1.35(GPIO4_A5) U7.D1(B4)
I2S0-SCLK/: CON1.12(GPIO4_A3) U7.A1(B1)
MDI0+: U1.186(GBE-MDI0P) ; port PHY1_MDI_0+
MDI0-: U1.184(GBE-MDI0N) ; port PHY1_MDI_0-
MDI1+: U1.192(GBE-MDI1P) ; port PHY1_MDI_1+
MDI1-: U1.190(GBE-MDI1N) ; port PHY1_MDI_1-
MDI2+: U1.198(GBE-MDI2-P) ; port PHY1_MDI_2+
MDI2-: U1.196(GBE-MDI2N) ; port PHY1_MDI_2-
MDI3+: U1.204(GBE-MDI3P) ; port PHY1_MDI_3+
MDI3-: U1.202(GBE-MKI3N) ; port PHY1_MDI_3-
SPI0-CS0: CON1.24(GPIO1_B2) U3.D1(B4)
SPI0-CS1: CON1.26(ADC_IN0) U5.A1(B1)
SPI0-MISO: CON1.21(GPIO1_A7) U3.B1(B2)
SPI0-MOSI: CON1.19(GPIO1_B0) U3.C1(B3)
SPI0-SCK: CON1.23(GPIO1_B1) U3.A1(B1)
SPI1-CS0: CON1.18(GPIO4_D4) U4.D1(B4)
SPI1-CS1: CON1.16(GPIO4_D2) U6.A1(B1)
SPI1-MISO: CON1.22(GPIO4_D5) U4.B1(B2)
SPI1-MOSI: CON1.37(GPIO4_D6) U4.C1(B3)
SPI1-SCK: CON1.13(GPIO4_C6) U4.A1(B1)
UART1-CTS: CON1.36(GPIO4_A4) U6.D1(B4)
UART1-RTS: CON1.11(GPIO4_C2) U5.D1(B4)
VIN: U1.252(252VIN) U1.254(254VIN) U1.256(256VIN) U1.258(258VIN) U1.260(260VIN)
NetC54_2: U1.136(PCIE0-TX0P) ; port PCIE20_0_TXP
NetC55_2: U1.134(PCIE0-TX0N) ; port PCIE20_0_TXN
NetC90472_2: U1.98(DP1-AUXN) ; port HDMI-SDA
NetCON1_3: CON1.3(I2C7_SDA) U1.143(CAN-RX) ; port BT_REG_ON_H
NetCON1_5: CON1.5(I2C7_SCL) U1.145(CAN-TX) ; port CHRG_OK_H
NetCON1_8: CON1.8(GPIO4_C3) ; port UART2-TX/
NetCON1_10: CON1.10(GPIO4_C4) ; port UART2-RX/
NetCON1_27: CON1.27(GPIO2_A0) R8.1 U1.187(I2C0-SDA) ; port I2C0_SDA_M2
NetCON1_28: CON1.28(GPIO2_A1) R7.1 U1.185(I2C0-SCL) ; port I2C0_SCL_M2
NetD1_1: D1.1(A) J2.1
NetD9_1: U1.229(SDMMC-CLK) ; port SDMMC_CLK
NetD5001_1: D5001.1(A) Q9518.3(DRAIN) U90087.1
NetED4807_1: U1.214(FORCE-RECOVERY) ; port SARADC_VIN0_BOOT
NetED8128_1: U1.237(POWER-EN) ; port POWER-KEY
NetFB6605_2: U1.115(USB1-DN) ; port TYPEC0_OTG_DM
NetFB6605_4: U1.117(USB1-DP) ; port TYPEC0_OTG_DP
NetJ9809_2: U1.215(CAM-I2C-SDA) ; port WIFI_REG_ON_H
NetJ9809_3: U1.213(CAM-I2C-SCL) ; port GAUGE_ALRT
NetJ9809_4: U1.116(CAM0-MCLK) ; port I2C6_SCL_M3
NetJ9809_5: U1.114(CAM0-PWDN) ; port MIPI_CAM1_PDN_L
NetJ9809_7: U1.12(CSI0-CLKP) ; port MIPI_CSI0_RX_CLK1P
NetJ9809_8: U1.10(CSI0-CLKN) ; port MIPI_CSI0_RX_CLK1N
NetJ9809_10: U1.18(CSI0-D1P) ; port MIPI_CSI0_RX_D3P
NetJ9809_11: U1.16(CSI0-D1N) ; port MIPI_CSI0_RX_D3N
NetJ9809_13: U1.6(CSI0-D0P) ; port MIPI_CSI0_RX_D2P
NetJ9809_14: U1.4(CSI0-D0N) ; port MIPI_CSI0_RX_D2N
NetJ9810_2: R6.1 U1.191(I2C1-SDA) ; port CC_INT0_L
NetJ9810_3: R5.1 U1.189(I2C1-SCL) ; port BT_WAKE_HOST_H
NetJ9810_5: U1.120(CAM1-PWDN) ; port MIPI_CAM2_PDN_L
NetJ9810_7: U1.30(CSI2-CLKP) ; port MIPI_DPHY0_RX_CLKP
NetJ9810_8: U1.28(CSI2-CLKN) ; port MIPI_DPHY0_RX_CLKN
NetJ9810_10: U1.36(CSI2-D1P) ; port MIPI_DPHY0_RX_D1P
NetJ9810_11: U1.34(CSI2-D1N) ; port MIPI_DPHY0_RX_D1N
NetJ9810_13: U1.24(CSI2-D0P) ; port MIPI_DPHY0_RX_D0P
NetJ9810_14: U1.22(CSI2-D0N) ; port MIPI_DPHY0_RX_D0N
NetQ18_1: U1.126(GPIO03) ; port LCD_RESET_L
NetQ19_1: U1.128(GPIO05) ; port BQ_OTG_EN_H
NetQ9518_1: Q9518.1(GATE) R95059.1
NetQ9518_2: Q9518.2(SOURCE) R95060.1
NetQ9529_2: U1.100(DP1-AUXP) ; port HDMI-SCL
NetQ9533_2: U1.94(HDMI-CEC) ; port HDMI_TX0_CEC_M0
NetQ9539_3: U1.88(DP0-HPD) ; port SDMMC_PWREN
NetQ9555_1: U6.B1(B2) ; port OTGVCC_EN
NetQ9555_3: U1.87(GPIO00) ; port USB-DET
NetQ9557_3: U1.96(DP1-HPD) ; port HDMI_TX0_HPD_M0
NetR9_1: R9.1 U1.240(SLLEP/WAKE) ; port PWR_BTN
NetR57_1: U1.124(GPIO02) ; port MIPI_CAM1_PWREN_H
NetR60_1: U1.181(PCIE0-RST) ; port PCIE20x1_2_PERSTn_M0
NetR61_1: U1.212(GPIO10) ; port I2S0_MCLK
NetR76_1: U1.188(GBE-LED-LINK) ; port LEFT-LINK
NetR77_1: U1.194(GBE-LED-ACT) ; port RIGHT-ACT
NetR113_2: U1.130(GPIO06) ; port RK803_EN1_Flood
NetR122_2: U1.239(SYS-RESET) ; port RESET_L
NetR138_1: U1.223(SDMMC-D2) ; port SDMMC_D2
NetR139_1: U1.225(SDMMC-D3) ; port SDMMC_D3
NetR140_1: U1.227(SDMMC-CMD) ; port SDMMC_CMD
NetR141_1: U1.219(SDMMC-D0) ; port SDMMC_D0
NetR142_1: U1.221(SDMMC-D1) ; port SDMMC_D1
NetR145_1: U1.208(GPIO08) ; port SDMMC_DET_L
NetR95059_2: R95059.2 U1.211(GPIO09) ; port USB_HOST_PWREN_H
NetR95180_1: U1.127(GPIO04) ; port PHONE_CTL
NetR95201_2: U1.182(PCIE1-CLKREQ) ; port PCIE1-CLKREQ
NetR95204_1: U1.183(PCIE1-RST) ; port MIPI_CAM3_PDN_L
NetR95208_1: U1.178(MOD-SLEEP) ; port I2C6_SDA_M3
NetR95217_1: U1.47(DP0-TXD1P) ; port TYPEC0_SSRX1P
NetR95218_1: U1.45(DP0-TXD1N) ; port TYPEC0_SSRX1N
NetR95219_1: U1.41(DP0-TXD0P) ; port TYPEC0_SSTX1P
NetR95220_1: U1.39(DP0-TXD0N) ; port TYPEC0_SSTX1N
NetR95221_1: U1.163(USBSS-RXP) ; port TYPEC0_SSRX2P
NetR95222_1: U1.161(USBSS-RXN) ; port TYPEC0_SSRX2N
NetR95223_1: U1.168(USBSS-TXP) ; port TYPEC0_SSTX2P
NetR95224_1: U1.166(USBSS-TXN) ; port TYPEC0_SSTX2N
NetR95225_1: U1.92(DP0-AUXP) ; port TYPEC0_SBU1
NetR95226_1: U1.90(DP0-AUXN) ; port TYPEC0_SBU2
NetR95227_1: U1.180(PCIE0-CLKREQ) ; port PCIE20x1_2_CLKREQn_M0
NetU1_3: U1.3(CSI1-D0N) ; port MIPI_CSI0_RX_D0N
NetU1_5: U1.5(CSI1-D0P) ; port MIPI_CSI0_RX_D0P
NetU1_9: U1.9(CSI1-CLKN) ; port MIPI_CSI0_RX_CLK0N
NetU1_11: U1.11(CSI1-CLKP) ; port MIPI_CSI0_RX_CLK0P
NetU1_15: U1.15(CSI1-D1N) ; port MIPI_CSI0_RX_D1N
NetU1_17: U1.17(CSI1-D1P) ; port MIPI_CSI0_RX_D1P
NetU1_40: U1.40(CSI4-D2N) ; port MIPI_DPHY1_RX_D2N
NetU1_42: U1.42(CSI4-D2P) ; port MIPI_DPHY1_RX_D2P
NetU1_46: U1.46(CSI4-D0N) ; port MIPI_DPHY1_RX_D0N
NetU1_48: U1.48(CSI4-D0P) ; port MIPI_DPHY1_RX_D0P
NetU1_51: U1.51(DP0-TXD2N) ; port DP-TXD2N
NetU1_52: U1.52(CSI4-CLKN) ; port MIPI_DPHY1_RX_CLKN
NetU1_53: U1.53(DP0-TXD2P) ; port DP-TXD2P
NetU1_54: U1.54(CSI4-CLKP) ; port MIPI_DPHY1_RX_CLKP
NetU1_57: U1.57(DP0-TXD3N) ; port DP-TXD3N
NetU1_58: U1.58(CSI4-D1N) ; port MIPI_DPHY1_RX_D1N
NetU1_59: U1.59(DP0-TXD3P) ; port DP-TXD3P
NetU1_60: U1.60(CSI4-D1P) ; port MIPI_DPHY1_RX_D1P
NetU1_64: U1.64(CSI4-D3N) ; port MIPI_DPHY1_RX_D3N
NetU1_66: U1.66(CSI4-D3P) ; port MIPI_DPHY1_RX_D3P
NetU1_70: U1.70(DSI-D0N) ; port MIPI_DPHY0_TX_D0N
NetU1_72: U1.72(DSI-D0P) ; port MIPI_DPHY0_TX_D0P
NetU1_76: U1.76(DSI-CLKN) ; port MIPI_DPHY0_TX_CLKN
NetU1_78: U1.78(DSI-CLKP) ; port MIPI_DPHY0_TX_CLKP
NetU1_82: U1.82(DSI-D1N) ; port MIPI_DPHY0_TX_D1N
NetU1_84: U1.84(DSI-D1P) ; port MIPI_DPHY0_TX_D1P
NetU1_89: U1.89(SPI0-MOSI) U3.C3(A3) ; port MIPI_CAM1_RST_L
NetU1_91: U1.91(SPI0-SCK) U3.A3(A1) ; port MIPI_CAM2_RST_L
NetU1_93: U1.93(SPI0-MISO) U3.B3(A2) ; port MIPI_CAM2_PWREN_H
NetU1_95: U1.95(SPI0-CS0) U3.D3(A4) ; port TP_RST_L
NetU1_97: U1.97(SPI0-CS1) U5.A3(A1) ; port TP_INT_L
NetU1_99: U1.99(UART0-TXD) ; port I2C5_SCL_M3_CAM
NetU1_101: U1.101(UART0-RXD) ; port I2C5_SDA_M3_CAM
NetU1_103: U1.103(UART0-RTS) ; port I2C8_SCL_M2_CAM
NetU1_104: U1.104(SPI1-MOSI) U4.C3(A3) ; port I2C7_SDA_M0_CODEC
NetU1_105: U1.105(UART0-CTS) ; port I2C8_SDA_M2_CAM
NetU1_106: U1.106(SPI1-SCK) U4.A3(A1) ; port PDM0_SDI2_M0
NetU1_108: U1.108(SPI1-MISO) U4.B3(A2) ; port I2C7_SCL_M0_CODEC
NetU1_109: U1.109(USB0-DN) ; port USB20_HOST0_DM
NetU1_110: U1.110(SPI1-CS0) U4.D3(A4) ; port GSENSOR_INT_L
NetU1_111: U1.111(USB0-DP) ; port USB20_HOST0_DP
NetU1_112: U1.112(SPI1-CS1) U6.A3(A1) ; port PDM0_SDI0
NetU1_118: U1.118(GPIO01) U8.D3(A4) ; port HDMI0_TX_ON_H
NetU1_121: U1.121(USB2-DN) ; port USB20_HOST1_DM
NetU1_123: U1.123(USB2-DP) ; port USB20_HOST1_DP
NetU1_131: U1.131(PCIE0-RX0N) ; port PCIE20_0_RXN
NetU1_133: U1.133(PCIE0-RX0P) ; port PCIE20_0_RXP
NetU1_137: U1.137(PCIE0-RX1N) ; port PCIE20_0_RX1N
NetU1_139: U1.139(PCIE0-RX1P) ; port PCIE20_0_RX1P
NetU1_140: U1.140(PCIE0-TX1N) ; port PCIE20_0_TX1N
NetU1_142: U1.142(PCIE0-TX1P) ; port PCIE20_0_TX1P
NetU1_148: U1.148(PCIE0-TX2N) ; port PCIE20_0_TX2N
NetU1_149: U1.149(PCIE0-RX2N) ; port PCIE20_0_RX2N
NetU1_150: U1.150(PCIE0-TX2P) ; port PCIE20_0_TX2P
NetU1_151: U1.151(PCIE0-RX2P) ; port PCIE20_0_RX2P
NetU1_154: U1.154(PCIE0-TX3N) ; port PCIE20_0_TX3N
NetU1_155: U1.155(PCIE0-RX3N) ; port PCIE20_0_RX3N
NetU1_156: U1.156(PCIE0-TX3P) ; port PCIE20_0_TX3P
NetU1_157: U1.157(PCIE0-RX3P) ; port PCIE20_0_RX3P
NetU1_160: U1.160(PCIE0-CLKN) ; port PCIE20_0_REFCLKN
NetU1_162: U1.162(PCIE0-CLKP) ; port PCIE20_0_REFCLKP
NetU1_167: U1.167(PCIE1-RX0N) ; port USB30_2_SSRXN
NetU1_169: U1.169(PCIE1-RX0P) ; port USB30_2_SSRXP
NetU1_172: U1.172(PCIE1-TX0N) ; port USB30_2_SSTXN
NetU1_173: U1.173(PCIE1-CLKN) ; port PCIE20_2_REFCLKN
NetU1_174: U1.174(PCIE1-TX0P) ; port USB30_2_SSTXP
NetU1_175: U1.175(PCIE1-CLKP) ; port PCIE20_2_REFCLKP
NetU1_179: U1.179(PCIE-WAKE) ; port PCIE20x1_2_WAKEn_M0/PWM8_M2
NetU1_193: U1.193(I2S0-DOUT) U7.B3(A2) ; port I2S0_SDO0
NetU1_195: U1.195(I2S0-DIN) U7.C3(A3) ; port I2S0_SDI0
NetU1_197: U1.197(I2S0-FS) U7.D3(A4) ; port I2S0_LRCK_TX
NetU1_199: U1.199(I2S0-SCLK) U7.A3(A1) ; port I2S0_SCLK_TX
NetU1_203: U1.203(UART1-TXD) U6.B3(A2) ; port UART9-TX
NetU1_205: U1.205(UART1-RXD) U6.C3(A3) ; port UART9-RX
NetU1_206: U1.206(GPIO07) U5.B3(A2) ; port RK803_EN2_PRO
NetU1_207: U1.207(UART1-RTS) U5.D3(A4) ; port UART9-RTSN
NetU1_209: U1.209(UART1-CTS) U6.D3(A4) ; port UART9-CTSN
NetU1_210: U1.210(CLK-32K-OUT) ; port 32KOUT_WIFI
NetU1_216: U1.216(GPIO11) U8.C3(A3) ; port WIFI_WAKE_HOST_H
NetU1_218: U1.218(GPIO12) U5.C3(A3) ; port RTC_INT_L
NetU1_220: U1.220(I2S1DOUT) ; port I2S1DOUT
NetU1_222: U1.222(I2S1DIN) ; port I2S1DIN
NetU1_224: U1.224(I2S1-FS) ; port TYPEC0_SBU1_DC
NetU1_226: U1.226(I2S1-SCLK) ; port TYPEC0_SBU2_DC
NetU1_228: U1.228(GPIO13) U8.B3(A2) ; port 1A1-PCIE20X1_1WAKE
NetU1_230: U1.230(GPIO14) U8.A3(A1) ; port HP_DET_L
NetU1_232: U1.232(I2C2-SCL) ; port I2C3-SCL
NetU1_233: U1.233(SHUTDOWN-REQ) ; port FORCE_OFF
NetU1_234: U1.234(I2C2-SDA) ; port I2C3-SDA
NetU1_235: U1.235(PMIE-BBAT) ; port BBAT
NetU1_236: U1.236(UART2-TXD) ; port UART2-TX
NetU1_238: U1.238(UART2-RXD) ; port UART2-RX

Not connected (* = marked no-connect by the designer): J2 3 4; TP85 1(TP); TP87 1(TP); TP88 1(TP); TP90 1(TP); TP92 1(TP); TP93 1(TP); U1 21(CSI3-D0N) 23(CSI3-D0P) 27(CSI3-CLKN) 29(CSI3-CLKP) 33(CSI3-D1N) 35(CSI3-D1P) 122(CAM1-MCLK) h1 h2; U6 C1(B3)

### Notes on the sheet
- SODIMM
- FAN
- I2C0
- (near J2) BAT

### Library data of the parts
C2-C6 C10 = CAPACITOR_0: PAGE: 1
C7 C9 = CAP NP_2: cap,10.00uF,+/-10%,10V,X5R,C0805; Manufacturer: TDK; RK PN: C2012X5R1A106K125AB; Priority: A; Tolerance: 10%; Dielectric: X5R; Voltage: 10V; Part Type: C0805; Manufacturer PN: C2012X5R1A106K125AB; Created by: JJJ
C8 = CAP NP_2: cap,10.00uF,+/-10%,10V,X5R,C0805; Manufacturer PN: C2012X5R1A106K125AB; Manufacturer: TDK; Tolerance: 10%; Priority: A; Dielectric: X5R; Voltage: 10V; Created by: JJJ; Part Type: C0805; RK PN: C2012X5R1A106K125AB
C90418 = CAP NP: cap,100.00nF,+/-10%,16V,X5R,C0402; Manufacturer: TDK; RK PN: C1005X5R1C104K050BA; Priority: A; Tolerance: 10%; Voltage: 16V; Dielectric: X5R; Part Type: C0402; Manufacturer PN: C1005X5R1C104K050BA; Created by: JJJ
C90419 = CAP NP: cap,100.00nF,+/-10%,16V,X5R,C0402; Manufacturer PN: C1005X5R1C104K050BA; Manufacturer: TDK; Tolerance: 10%; Priority: A; Voltage: 16V; Dielectric: X5R; Created by: JJJ; Part Type: C0402; RK PN: C1005X5R1C104K050BA
C90427 = CAP NP: cap,10.00uF,+/-10%,25V,X5R,C1206; Manufacturer PN: C3216X5R1E106K085AC; Manufacturer: TDK; Tolerance: 10%; C_Voltage: 6.3V; Priority: A; Voltage: 25V; Dielectric: X5R; Created by: JJJ; Part Type: C1206; RK PN: C3216X5R1E106K085AC
C90428 = CAP NP: cap,100.00nF,+/-10%,25V,X5R,C0402; Manufacturer: TDK; RK PN: C1005X5R1E104K050BC; Priority: A; Tolerance: 10%; Voltage: 25V; Dielectric: X5R; Part Type: C0402; Manufacturer PN: C1005X5R1E104K050BC; Created by: JJJ
CON1 = CN_4
D1 = DIODE: Schottky Barrier，B5819W SOD-123; Manufacturer: 长电; ROOM: CHG; Priority: A; RK PN: B5819W; Part Type: Schottky rectifier; Manufacturer PN: B5819W; Created by: JJJ
D5001 = DIODE_Dup2: Schottky Barrier，B5819WS SOD-323; Manufacturer: 长电; Priority: A; Created by: JJJ; Manufacturer PN: B5819WS; Part Type: Schottky rectifier; RK PN: B5819WS
Q9518 = MOSFET N: MOSFET-N,WNM3003 ,30V,+/-20V,4.0A,33m Ohm@Vgs=10V,43m Ohm@Vgs=4.5V,SOT23
R5-R9 = R_2
R95059 = RESISTOR: 通用厚膜电阻,49K9,+/-1%,R0402,1/16W.; Manufacturer: YAGEO; Tolerance: 1%; RK PN: RC0402FR-0749K9L; Priority: A; Wattage: 1/16W; Part Type: 通用厚膜电阻; Manufacturer PN: RC0402FR-0749K9L; Created by: YTL
R95060 = RESISTOR: 通用厚膜电阻,10K,+/-5%,R0402,1/16W.; Manufacturer: YAGEO; Tolerance: 5%; RK PN: RC0402JR-0710KL; Priority: A; Wattage: 1/16W; Part Type: 通用厚膜电阻; Manufacturer PN: RC0402JR-0710KL; Created by: YTL
TP85 TP87 TP88 TP90 TP92 TP93 = Test Point: MISC, Test Point, Test Point, SMD, TP30C_SMD; Company Part Status: Grove Base Cape for PocketBeagle; ASSY: DNP; CLASS: DISCRETE; PN: TP30C_SMD; Package Size: TP30C_SMD
U1 = DDR4SODIMM_1
U3-U8 = MP2610_0: 4-bit Bi-directional Level Shifter UM3204H; Part Number: PI4ULS5V104GAEX; Vendor: PERICOM
U90087 = CON3_6

## Nets that join several sheets
DCIN: 04 (D90010.1 Q9533.1), 06 (R95198.2 U41.6), 07 (U90096.5), 10 (R113.1 U30.5), 11 (U34.5), 12 (17 pins), 13 (8 pins)
GND: 04 (45 pins), 05 (20 pins), 06 (18 pins), 07 (14 pins), 08 (29 pins), 10 (18 pins), 11 (17 pins), 12 (36 pins), 13 (100 pins)
power-good: 04 (R95206.1 U90094.4 U90094.5), 05 (U14.A2), 06 (R75.1 R95203.2), 08 (9 pins), 12 (9 pins), 13 (16 pins)
VCC3V3_WF: 05 (14 pins), 12 (6 pins)
VCC4V0_SYS: 12 (8 pins), 13 (5 pins)
VCC_1V8: 04 (R95100.2 R95117.2 R95118.2 R95205.2), 05 (C53.2 R61.2 U14.B2 U14.C2), 06 (R95181.2), 08 (R144.2), 12 (C123.1 U36.5), 13 (18 pins)
HDMI1_TX0N_PORT/eDP1_TX_D0N: 04 (R95214.2 U90105.2), 13 (U1.75)
HDMI1_TX0P_PORT/eDP1_TX_D0P: 04 (R95213.2 U90105.1), 13 (U1.77)
HDMI1_TX1N_PORT/eDP1_TX_D1N: 04 (R95212.2 U90104.2), 13 (U1.69)
HDMI1_TX1P_PORT/eDP1_TX_D1P: 04 (R95211.2 U90104.1), 13 (U1.71)
HDMI1_TX2N_PORT/eDP1_TX_D2N: 04 (R95210.2 U4106.2), 13 (U1.63)
HDMI1_TX2P_PORT/eDP1_TX_D2P: 04 (R95209.2 U4106.1), 13 (U1.65)
HDMI1_TX3N_PORT/eDP1_TX_D3N: 04 (R95216.2 U90106.2), 13 (U1.81)
HDMI1_TX3P_PORT/eDP1_TX_D3P: 04 (R95215.2 U90106.1), 13 (U1.83)
MDI0+: 06 (J4.1), 13 (U1.186)
MDI0-: 06 (J4.2), 13 (U1.184)
MDI1+: 06 (J4.3), 13 (U1.192)
MDI1-: 06 (J4.6), 13 (U1.190)
MDI2+: 06 (J4.7), 13 (U1.198)
MDI2-: 06 (J4.8), 13 (U1.196)
MDI3+: 06 (J4.9), 13 (U1.204)
MDI3-: 06 (J4.10), 13 (U1.202)
NetC54_2: 05 (C54.2), 13 (U1.136)
NetC55_2: 05 (C55.2), 13 (U1.134)
NetC90472_2: 04 (C90472.2 Q9530.2 R95096.2), 13 (U1.98)
NetCON1_8: 05 (U14.B1), 13 (CON1.8)
NetCON1_10: 05 (U14.C1), 13 (CON1.10)
NetD9_1: 08 (D9.1 J9813.5), 13 (U1.229)
NetED4807_1: 06 (ED4807.1 SW9208.2), 13 (U1.214)
NetED8128_1: 06 (ED8128.1 SW9209.2), 13 (U1.237)
NetFB6605_2: 07 (FB6605.2), 13 (U1.115)
NetFB6605_4: 07 (FB6605.4), 13 (U1.117)
NetJ9809_2: 08 (J9809.2 R132.1), 13 (U1.215)
NetJ9809_3: 08 (J9809.3 R133.1), 13 (U1.213)
NetJ9809_4: 08 (J9809.4 R126.1), 13 (U1.116)
NetJ9809_5: 08 (J9809.5), 13 (U1.114)
NetJ9809_7: 08 (J9809.7), 13 (U1.12)
NetJ9809_8: 08 (J9809.8), 13 (U1.10)
NetJ9809_10: 08 (J9809.10), 13 (U1.18)
NetJ9809_11: 08 (J9809.11), 13 (U1.16)
NetJ9809_13: 08 (J9809.13), 13 (U1.6)
NetJ9809_14: 08 (J9809.14), 13 (U1.4)
NetJ9810_2: 08 (J9810.2), 13 (R6.1 U1.191)
NetJ9810_3: 08 (J9810.3), 13 (R5.1 U1.189)
NetJ9810_5: 08 (J9810.5), 13 (U1.120)
NetJ9810_7: 08 (J9810.7), 13 (U1.30)
NetJ9810_8: 08 (J9810.8), 13 (U1.28)
NetJ9810_10: 08 (J9810.10), 13 (U1.36)
NetJ9810_11: 08 (J9810.11), 13 (U1.34)
NetJ9810_13: 08 (J9810.13), 13 (U1.24)
NetJ9810_14: 08 (J9810.14), 13 (U1.22)
NetQ18_1: 05 (Q18.1), 13 (U1.126)
NetQ19_1: 05 (Q19.1), 13 (U1.128)
NetQ9529_2: 04 (Q9529.2 R95094.2), 13 (U1.100)
NetQ9533_2: 04 (Q9533.2 R95111.2), 13 (U1.94)
NetQ9539_3: 04 (Q9539.3 R95118.1), 13 (U1.88)
NetQ9555_1: 07 (Q9555.1 R95197.2 U90096.4), 13 (U6.B1)
NetQ9555_3: 07 (Q9555.3 R95191.1 R95192.1), 13 (U1.87)
NetQ9557_3: 04 (Q9557.3 R95114.1 R95205.1), 13 (U1.96)
NetR57_1: 05 (R57.1 U13.20), 13 (U1.124)
NetR60_1: 05 (R60.1 U13.52), 13 (U1.181)
NetR61_1: 05 (R61.1 U13.62), 13 (U1.212)
NetR76_1: 06 (R76.1), 13 (U1.188)
NetR77_1: 06 (R77.1), 13 (U1.194)
NetR113_2: 10 (R113.2 R95171.2 U30.4), 11 (U34.4), 13 (U1.130)
NetR122_2: 12 (R122.2 U37.4), 13 (U1.239)
NetR138_1: 08 (R138.1), 13 (U1.223)
NetR139_1: 08 (R139.1), 13 (U1.225)
NetR140_1: 08 (R140.1), 13 (U1.227)
NetR141_1: 08 (R141.1), 13 (U1.219)
NetR142_1: 08 (R142.1), 13 (U1.221)
NetR145_1: 08 (R145.1), 13 (U1.208)
NetR95180_1: 06 (R95180.1), 13 (U1.127)
NetR95201_2: 12 (R95201.2 U90103.4), 13 (U1.182)
NetR95204_1: 06 (R95204.1), 13 (U1.183)
NetR95208_1: 04 (R95208.1), 13 (U1.178)
NetR95217_1: 04 (R95217.1 U90107.3), 13 (U1.47)
NetR95218_1: 04 (R95218.1 U90107.4), 13 (U1.45)
NetR95219_1: 04 (R95219.1 U90108.3), 13 (U1.41)
NetR95220_1: 04 (R95220.1 U90108.4), 13 (U1.39)
NetR95221_1: 04 (R95221.1 U90109.3), 13 (U1.163)
NetR95222_1: 04 (R95222.1 U90109.4), 13 (U1.161)
NetR95223_1: 04 (R95223.1 U90110.3), 13 (U1.168)
NetR95224_1: 04 (R95224.1 U90110.4), 13 (U1.166)
NetR95225_1: 04 (R95225.1 U90111.3), 13 (U1.92)
NetR95226_1: 04 (R95226.1 U90111.4), 13 (U1.90)
NetR95227_1: 05 (R95227.1 U13.53), 13 (U1.180)
NetU1_99: 05 (U13.32), 13 (U1.99)
NetU1_101: 05 (U13.22), 13 (U1.101)
NetU1_103: 05 (U13.36), 13 (U1.103)
NetU1_105: 05 (U13.34), 13 (U1.105)
NetU1_121: 05 (U13.5), 13 (U1.121)
NetU1_123: 05 (U13.3), 13 (U1.123)
NetU1_131: 05 (U13.43), 13 (U1.131)
NetU1_133: 05 (U13.41), 13 (U1.133)
NetU1_160: 05 (U13.49), 13 (U1.160)
NetU1_162: 05 (U13.47), 13 (U1.162)
NetU1_179: 05 (U13.55), 13 (U1.179)
NetU1_210: 05 (U14.A3), 13 (U1.210)
NetU1_220: 05 (U13.12), 13 (U1.220)
NetU1_222: 05 (U13.14), 13 (U1.222)
NetU1_224: 05 (U13.10), 13 (U1.224)
NetU1_226: 05 (U13.8), 13 (U1.226)
NetU1_236: 05 (U14.B3), 13 (U1.236)
NetU1_238: 05 (U14.C3), 13 (U1.238)